# EAGLE schematic plugV8-Relay-NO (EAGLE 7.5.0)
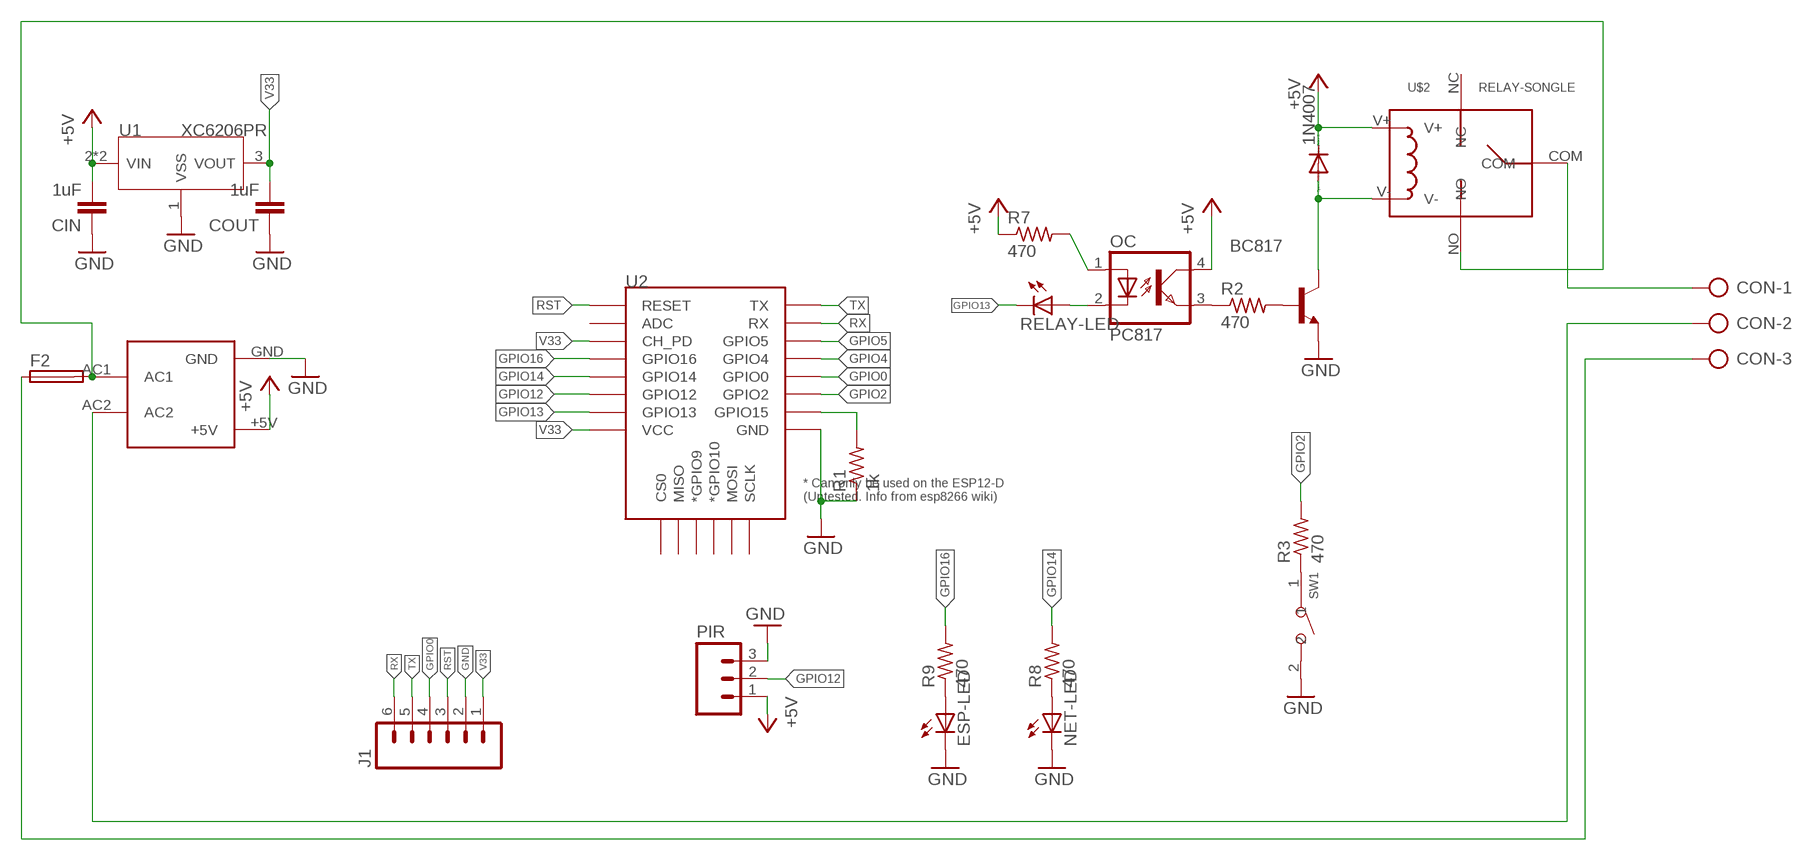
[diagram p0: schematic, sheet 1]

## Parts
1N4007  CGRM4007-G  [SOD-123_MINI-SMA]
BC817  BC817-NPN-SOT23-BEC  [SOT23-BEC]
CIN  1uF  C-EUC0805  [C0805]
CON  AK300/3  [AK300/3]
COUT  1uF  C-EUC0805  [C0805]
ESP-LED  LED3MM  [LED3MM]
F2  TR5  [TR5]
J1  M06SILK_FEMALE_PTH  [1X06]
NET-LED  LED3MM  [LED3MM]
OC  PC817  [DIL04]
PIR  M03POLAR  [MOLEX-1X3]
R1  1k  R-US_0204/2V  [0204V]
R2  470  R-US_0204/2V  [0204V]
R3  470  R-US_0204/2V  [0204V]
R7  470  R-US_0204/2V  [0204V]
R8  470  R-US_0204/2V  [0204V]
R9  470  R-US_0204/2V  [0204V]
RELAY-LED  LED3MM  [LED3MM]
SW1  DIP-BUTTON(2P-6.0X3.0X4.3MM)-TS-1101F  [SW2-5.0-6.0X3.0X4.3MM]
U1  XC6206PR  [SOT89]
U2  ESP12ESMD  [ESP12E-SMD]
U$1  HLK-PM01  [HLK-PM01]
U$2  RELAY-SONGLE  [RELAY-SONGLE]

## Nets
+5V: 1N4007.C CIN.2 OC.4(COL) PIR.1 R7.1 U1.2(VIN) U1.4(VIN) U$1.+5V U$2.V+
GND: BC817.E CIN.1 COUT.1 ESP-LED.K(C) J1.2 NET-LED.K(C) PIR.3 R1.1 SW1.2 U1.1(VSS) U2.GND U$1.GND
GPIO0: J1.4 U2.GPIO0
GPIO2: R3.2 U2.GPIO2
GPIO4: U2.GPIO4
GPIO5: U2.GPIO5
GPIO12: PIR.2 U2.GPIO12
GPIO13: RELAY-LED.K(C) U2.GPIO13
GPIO14: R8.2 U2.GPIO14
GPIO16: R9.2 U2.GPIO16
N$1: F2.2 U$1.AC1 U$2.NO
N$2: OC.3(EMIT) R2.1
N$3: CON.2 U$1.AC2
N$4: CON.1 U$2.COM
N$5: BC817.B R2.2
N$6: OC.2(C) RELAY-LED.A
N$7: ESP-LED.A R9.1
N$8: NET-LED.A R8.1
N$9: R3.1 SW1.1
N$10: CON.3 F2.1
N$11: R1.2 U2.GPIO15
N$13: OC.1(A) R7.2
N$18: 1N4007.A BC817.C U$2.V-
RST: J1.3 U2.RESET
RX: J1.6 U2.RXD0(RX)
TX: J1.5 U2.TXD0(TX)
V33: COUT.2 J1.1 U1.3(VOUT) U2.CH_PD U2.VCC
Unconnected: U2.ADC U2.CS0 U2.GPIO9(*GPIO9) U2.GPIO10(*GPIO10) U2.MISO U2.MOSI U2.SCLK U$2.NC

## Library data of the parts
1N4007 = diode:CGRM400*-G: Molded plasitc,JEDEC SOD-123/Mini SMA Source: Comchip CGRM4001-G.pdf
BC817 = transistor-neu-to92:*-NPN-: NPN Transistror
CIN COUT = rcl:C-EU: CAPACITOR, European symbol
CON = con-ptr500:AK300/3: CONNECTOR; OC_FARNELL: unknown; OC_NEWARK: unknown
ESP-LED NET-LED RELAY-LED = led:LED: LED OSRAM: - CHIPLED LG R971, LG N971, LY N971, LG Q971, LY Q971, LO R971, LY R971 LH N974, LH R974 LS Q976, LO Q976, LY Q976 LO Q996 - Hyper CHIPLED LW Q18S LB Q993, LB Q99A, LB R99A - SideLED LS A670, LO A670, LY A670, LG A670, LP A670 LB A673, LV A673, LT A673, LW A673 LH A674 LY A675 LS A676, LA A676, LO A676, LY A676, LW A676 LS A679, LY A679, LG A679 - Hyper Micro SIDELED® LS Y876, LA Y876, LO Y876, LY Y876 LT Y87S - SmartLED LW L88C, LW L88S LB L89C, LB L89S, LG L890 LS L89K, LO L89K, LY L89K LS L896, LA L896, LO L896, LY L896 - TOPLED LS T670, LO T670, LY T670, LG T670, LP T670 LSG T670, LSP T670, LSY T670, LOP T670, LYG T670 LG T671, LOG T671, LSG T671 LB T673, LV T673, LT T673, LW T673 LH T674 LS T676, LA T676, LO T676, LY T676, LB T676, LH T676, LSB T676, LW T676 LB T67C, LV T67C, LT T67C, LS T67K, LO T67K, LY T67K, LW E67C LS E67B, LA E67B, LO E67B, LY E67B, LB E67C, LV E67C, LT E67C LW T67C LS T679, LY T679, LG T679 LS T770, LO T770, LY T770, LG T770, LP T770 LB T773, LV T773, LT T773, LW T773 LH T774 LS E675, LA E675, LY E675, LS T675 LS T776, LA T776, LO T776, LY T776, LB T776 LHGB T686 LT T68C, LB T68C - Hyper Mini TOPLED® LB M676 - Mini TOPLED Santana® LG M470 LS M47K, LO M47K, LY M47K Source: http://www.osram.convergy.de LUXEON: - LUMILED® LXK2-PW12-R00, LXK2-PW12-S00, LXK2-PW14-U00, LXK2-PW14-V00 LXK2-PM12-R00, LXK2-PM12-S00, LXK2-PM14-U00 LXK2-PE12-Q00, LXK2-PE12-R00, LXK2-PE12-S00, LXK2-PE14-T00, LXK2-PE14-U00 LXK2-PB12-K00, LXK2-PB12-L00, LXK2-PB12-M00, LXK2-PB14-N00, LXK2-PB14-P00, LXK2-PB14-Q00 LXK2-PR12-L00, LXK2-PR12-M00, LXK2-PR14-Q00, LXK2-PR14-R00 LXK2-PD12-Q00, LXK2-PD12-R00, LXK2-PD12-S00 LXK2-PH12-R00, LXK2-PH12-S00 LXK2-PL12-P00, LXK2-PL12-Q00, LXK2-PL12-R00 Source: www.luxeon.com KINGBRIGHT: KA-3528ASYC Source: www.kingbright.com
F2 = fuse:TR5: FUSE Wickmann; OC_FARNELL: unknown; OC_NEWARK: unknown
J1 = SparkFun-Connectors:M06: Header 6 Standard 6-pin 0.1" header. Use with straight break away headers (SKU : PRT-00116), right angle break away headers (PRT-00553), swiss pins (PRT-00743), machine pins (PRT-00117), and female headers (PRT-00115). Molex polarized connector foot print use with SKU : PRT-08094 with associated crimp pins and housings. NOTES ON THE VARIANTS LOCK and LOCK_LONGPADS... This footprint was designed to help hold the alignment of a through-hole component (i.e. 6-pin header) while soldering it into place. You may notice that each hole has been shifted either up or down by 0.005 of an inch from it's more standard position (which is a perfectly straight line). This slight alteration caused the pins (the squares in the middle) to touch the edges of the holes. Because they are alternating, it causes a "brace" to hold the component in place. 0.005 has proven to be the perfect amount of "off-center" position when using our standard breakaway headers. Although looks a little odd when you look at the bare footprint, once you have a header in there, the alteration is very hard to notice. Also,if you push a header all the way into place, it is covered up entirely on the bottom side. This idea of altering the position of holes to aid alignment will be further integrated into the Sparkfun Library for other footprints. It can help hold any component with 3 or more connection pins.; PROD_ID: CONN-08437
OC = optocoupler:PC817: SHARP OPTO COUPLER; MPN: PC817X4J000F; OC_FARNELL: 9707727; OC_NEWARK: 97K7059
PIR = SparkFun-Connectors:M03: Header 3 Standard 3-pin 0.1" header. Use with straight break away headers (SKU : PRT-00116), right angle break away headers (PRT-00553), swiss pins (PRT-00743), machine pins (PRT-00117), and female headers (PRT-00115). Molex polarized connector foot print use with SKU : PRT-08232 with associated crimp pins and housings.
R1-R3 R7-R9 = rcl:R-US_: RESISTOR, American symbol
SW1 = Seeed-OPL-Switch:DIP-BUTTON(2P-6.0X3.0X4.3MM): 311020025
U1 = IC:XC6206: LOW ESR Cap.Compatible Positive Voltage Regulators
U2 = esp8266modules:ESP12E: ESP12E Module
U$1 = HLK-PM01:HLK-PM01
U$2 = Seeed-OPL-Relay:RELAY-SONGLE